# Altium schematic sheet Ethernet HPS Interface.SchDoc (part 2 of 2)
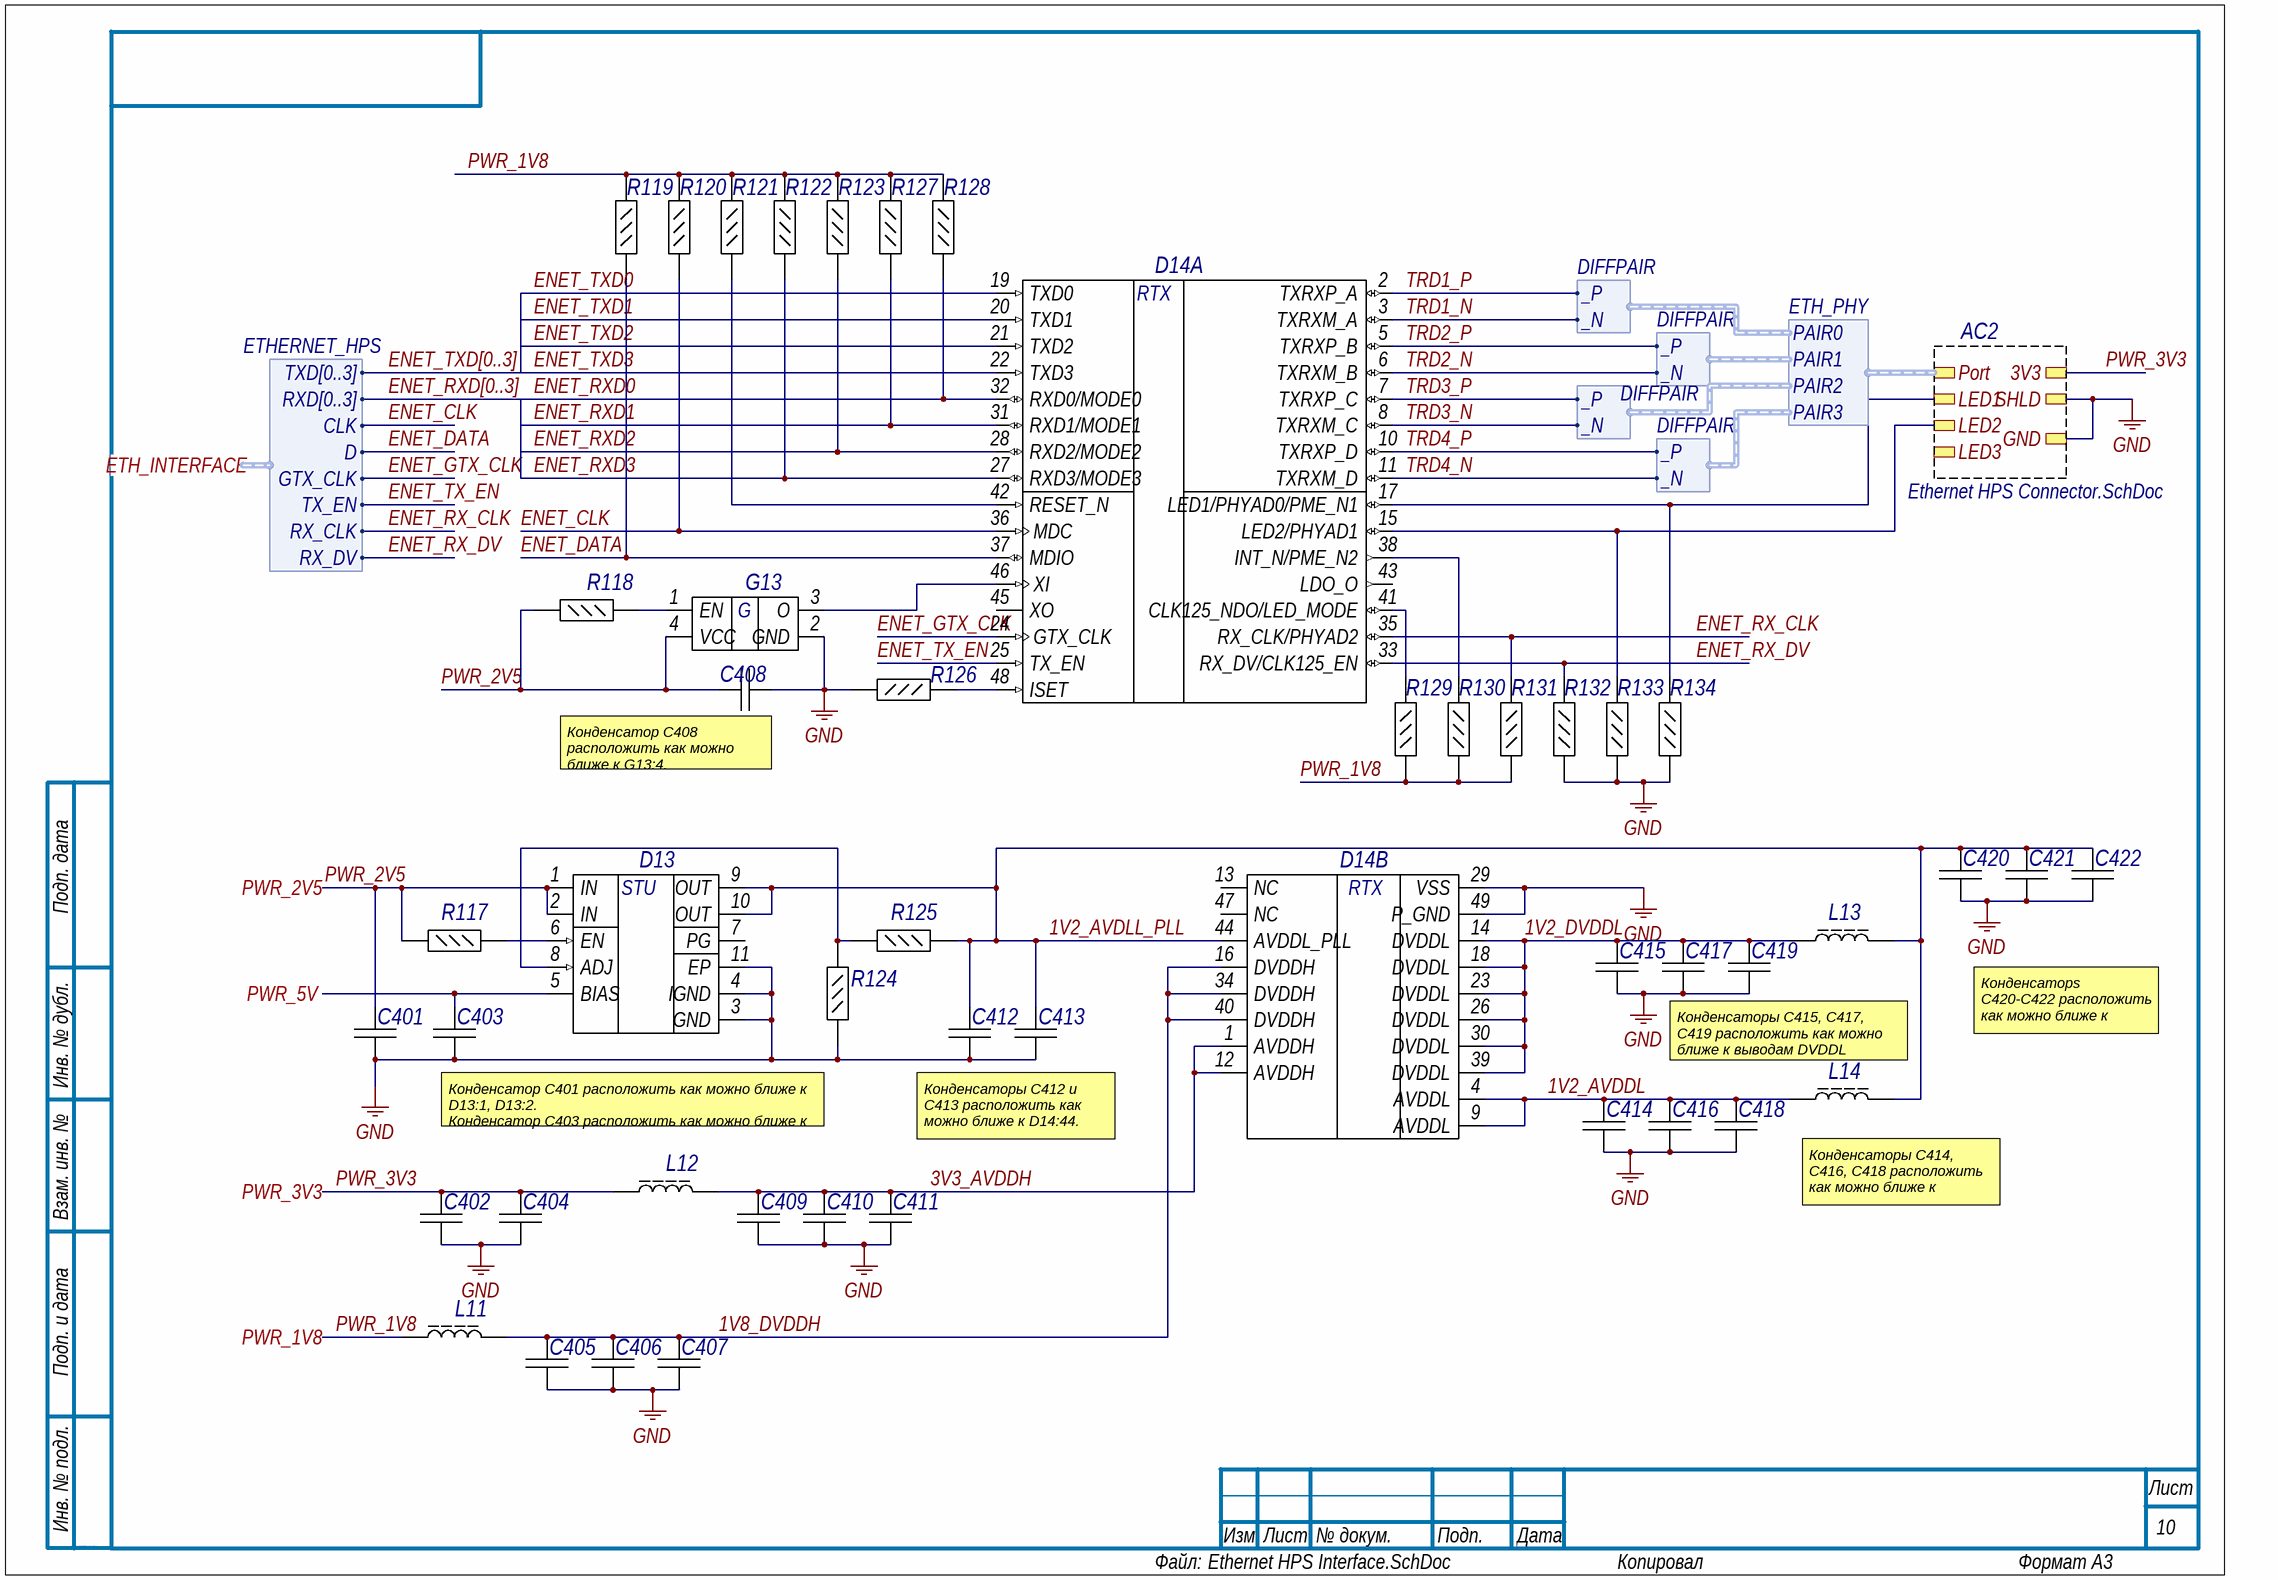
[diagram p1: Ethernet HPS Interface.SchDoc]

## Library data of the parts
C401 = E25: Chip Capacitor, 10 uF, +/- 10%, 16 V, -55 to 85 degC, 0805 (2012 Metric), RoHS, Tape and Reel; Тип элемента: Конденсатор; Capacitance: 10 uF; Case\/Package: 0805; Type (Capacitors): X5R; Voltage Rating: 16 V; Old_des: C370; New_des: C410; UID: E25; Component Kind: Standard; Case Code (Imperial): 0805; Case Code (Metric): 2012; ComponentLink1Description: Manufacturer URL; ComponentLink1URL: http://www.tdk.com/; ComponentLink2Description: Datasheet; ComponentLink2URL: https://product.tdk.com/info/en/catalog/datasheets/mlcc_commercial_general_en.pdf; DatasheetVersion: 03/2015; Length: 2 mm; Max Operating Temperature: 85 degC; Min Operating Temperature: -55 degC; Mounting Technology: Surface Mount; Package Quantity: 1; PackageDescription: 2-Pin Surface Mount Device, Body 2 x 1.25 mm; Packaging: Tape and Reel; RoHSCompliant: true; Tolerance: 10%; Width: 1.25 mm; Height: 0.85 mm; Mount: Surface Mount; PackageReference: 0805; Pins: 2; REACH SVHC: No SVHC; Voltage Rating (DC): 16 V
C402 = E25: Chip Capacitor, 10 uF, +/- 10%, 16 V, -55 to 85 degC, 0805 (2012 Metric), RoHS, Tape and Reel; Тип элемента: Конденсатор; Capacitance: 10 uF; Case\/Package: 0805; Type (Capacitors): X5R; Voltage Rating: 16 V; Old_des: C376; New_des: C411; UID: E25; Component Kind: Standard; Case Code (Imperial): 0805; Case Code (Metric): 2012; ComponentLink1Description: Manufacturer URL; ComponentLink1URL: http://www.tdk.com/; ComponentLink2Description: Datasheet; ComponentLink2URL: https://product.tdk.com/info/en/catalog/datasheets/mlcc_commercial_general_en.pdf; DatasheetVersion: 03/2015; Length: 2 mm; Max Operating Temperature: 85 degC; Min Operating Temperature: -55 degC; Mounting Technology: Surface Mount; Package Quantity: 1; PackageDescription: 2-Pin Surface Mount Device, Body 2 x 1.25 mm; Packaging: Tape and Reel; RoHSCompliant: true; Tolerance: 10%; Width: 1.25 mm; Height: 0.85 mm; Mount: Surface Mount; PackageReference: 0805; Pins: 2; REACH SVHC: No SVHC; Voltage Rating (DC): 16 V
C403 = E2: Chip Capacitor, 1 uF, +/- 10%, 25 V, -55 to 85 degC, 0402 (1005 Metric), RoHS, Tape and Reel; Тип элемента: Конденсатор; Capacitance: 1 uF; Old_des: C384; New_des: C412; UID: E2; Component Kind: Standard; Case Code (Imperial): 0402; Case Code (Metric): 1005; Case/Package: 0402; ComponentLink1Description: Manufacturer URL; ComponentLink1URL: http://www.tdk.com/; ComponentLink2Description: Datasheet; ComponentLink2URL: https://product.tdk.com/info/en/catalog/datasheets/mlcc_commercial_lowprofile_en.pdf; DatasheetVersion: 04/2015; Length: 0.039 inch; Max Operating Temperature: 85 degC; Min Operating Temperature: -55 degC; Mounting Technology: Surface Mount; Package Quantity: 1; PackageDescription: 2-Pin Surface Mount Device, Body 1 x 0.5 mm; Packaging: Tape and Reel; PartNumber: CGB2A1X5R1E105K033BC; RoHSCompliant: True; Tolerance: 10%; Width: 0.02 inch
C404 = E25: Chip Capacitor, 10 uF, +/- 10%, 16 V, -55 to 85 degC, 0805 (2012 Metric), RoHS, Tape and Reel; Тип элемента: Конденсатор; Capacitance: 10 uF; Case\/Package: 0805; Type (Capacitors): X5R; Voltage Rating: 16 V; Old_des: C377; New_des: C413; UID: E25; Component Kind: Standard; Case Code (Imperial): 0805; Case Code (Metric): 2012; ComponentLink1Description: Manufacturer URL; ComponentLink1URL: http://www.tdk.com/; ComponentLink2Description: Datasheet; ComponentLink2URL: https://product.tdk.com/info/en/catalog/datasheets/mlcc_commercial_general_en.pdf; DatasheetVersion: 03/2015; Length: 2 mm; Max Operating Temperature: 85 degC; Min Operating Temperature: -55 degC; Mounting Technology: Surface Mount; Package Quantity: 1; PackageDescription: 2-Pin Surface Mount Device, Body 2 x 1.25 mm; Packaging: Tape and Reel; RoHSCompliant: true; Tolerance: 10%; Width: 1.25 mm; Height: 0.85 mm; Mount: Surface Mount; PackageReference: 0805; Pins: 2; REACH SVHC: No SVHC; Voltage Rating (DC): 16 V
C405 = E5: Chip Capacitor, 22 uF, +/- 10%, 25 V, -55 to 85 degC, 1206 (3216 Metric), RoHS, Tape and Reel; Тип элемента: Конденсатор; Capacitance: 22 uF; Case\/Package: 1206; Type (Capacitors): X5R; Voltage Rating: 25 V; Old_des: C385; New_des: C414; UID: E5; Component Kind: Standard; Case Code (Imperial): 1206; Case Code (Metric): 3216; ComponentLink1Description: Manufacturer URL; ComponentLink1URL: http://www.murata.com/; ComponentLink2Description: Datasheet; ComponentLink2URL: http://search.murata.co.jp/Ceramy/image/img/A01X/G101/ENG/GRM31CR61E226KE15-01.pdf; DatasheetVersion: 03/2016; Length: 3.2 mm; Max Operating Temperature: 85 degC; Min Operating Temperature: -55 degC; Mounting Technology: Surface Mount; Package Quantity: 2000; PackageDescription: 2-Pin Surface Mount Device, Body 3.2 x 1.6 mm; Packaging: Tape and Reel; PartNumber: GRM31CR61E226KE15L; RoHSCompliant: true; Tolerance: 10%; Width: 1.6 mm; Height: 1.6 mm; Mount: Surface Mount; PackageReference: 1206; Pins: 2; Radiation Hardening: No; REACH SVHC: No SVHC; Voltage Rating (DC): 25 V
C406 = E23: Chip Capacitor, 2.2 uF, +/- 10%, 10 V, -55 to 85 degC, 0603 (1608 Metric), RoHS, Tape and Reel; Тип элемента: Конденсатор; Capacitance: 2.2 uF; Old_des: C386; New_des: C415; UID: E23; Component Kind: Standard; Case Code (Imperial): 0603; Case Code (Metric): 1608; Case/Package: 0603; ComponentLink1Description: Manufacturer URL; ComponentLink1URL: http://www.murata.com/; ComponentLink2Description: Datasheet; ComponentLink2URL: https://datasheet.ciiva.com/134/grm188r61a225ke34-01-134206.pdf; DatasheetVersion: 01/2013; Length: 0.063 inch; Max Operating Temperature: 85 degC; Min Operating Temperature: -55 degC; Mounting Technology: Surface Mount; Package Quantity: 10000; PackageDescription: 2-Pin Surface Mount Device, Body 1.6 x 0.8 mm; Packaging: Tape and Reel; PartNumber: GRM188R61A225KE34x; RoHSCompliant: True; Tolerance: 10%; Width: 0.031 inch; Height: 0.8 mm; Radiation Hardening: No
C407 = E11: Chip Capacitor, 0.1 uF, +/- 20%, 25 V, -55 to 125 degC, 0402 (1005 Metric), RoHS, Tape and Reel; Тип элемента: Конденсатор; Capacitance: 100 nF; Case\/Package: 0402; Type (Capacitors): X7R; Voltage Rating: 25 V; Old_des: C387; New_des: C416; UID: E11; Component Kind: Standard; Case Code (Imperial): 0402; Case Code (Metric): 1005; ComponentLink1Description: Manufacturer URL; ComponentLink1URL: http://www.tdk.com/; ComponentLink2Description: Datasheet; ComponentLink2URL: http://www.farnell.com/datasheets/1571323.pdf; DatasheetVersion: 09/2011; Length: 1 mm; Max Operating Temperature: 125 degC; Min Operating Temperature: -55 degC; Mounting Technology: Surface Mount; Package Quantity: 10000; PackageDescription: 2-Pin Surface Mount Device, Body 1 x 0.5 mm; Packaging: Tape and Reel; PartNumber: C1005X7R1E104M; RoHSCompliant: true; Tolerance: 20%; Width: 0.5 mm; Height: 0.5 mm; Mount: Surface Mount; PackageReference: 0402; Pins: 2; Voltage Rating (DC): 25 V
C408 = E3: Chip Capacitor, 10 nF, +/- 10%, 50 V, -55 to 125 degC, 0402 (1005 Metric), RoHS, Tape and Reel; Manufacturer: Basic Passives; Тип элемента: Конденсатор; Capacitance: 10 nF; Case\/Package: 0402; Type (Capacitors): X7R; Voltage Rating: 50 V; Old_des: C366; New_des: C417; UID: E3; Component Kind: Standard; Case Code (Imperial): 0402; Case Code (Metric): 1005; ComponentLink1Description: Manufacturer URL; ComponentLink1URL: http://www.murata.com/; ComponentLink2Description: Datasheet; ComponentLink2URL: http://search.murata.co.jp/Ceramy/image/img/A01X/G101/ENG/GRM155R71H103KA88-01.pdf; DatasheetVersion: 02/2016; Length: 1 mm; Max Operating Temperature: 125 degC; Min Operating Temperature: -55 degC; Mounting Technology: Surface Mount; Package Quantity: 10000; PackageDescription: 2-Pin Surface Mount Device, Body 1 x 0.5 mm; Packaging: Tape and Reel; PartNumber: GRM155R71H103KA88D; RoHSCompliant: true; Tolerance: 10%; Width: 0.5 mm; Height: 0.5 mm; Lead Pitch: 2mm; Mount: Surface Mount; PackageReference: 0402; Pins: 2; Radiation Hardening: No; REACH SVHC: No SVHC; Voltage Rating (DC): 50 V
C409 = E5: Chip Capacitor, 22 uF, +/- 10%, 25 V, -55 to 85 degC, 1206 (3216 Metric), RoHS, Tape and Reel; Тип элемента: Конденсатор; Capacitance: 22 uF; Case\/Package: 1206; Type (Capacitors): X5R; Voltage Rating: 25 V; Old_des: C378; New_des: C418; UID: E5; Component Kind: Standard; Case Code (Imperial): 1206; Case Code (Metric): 3216; ComponentLink1Description: Manufacturer URL; ComponentLink1URL: http://www.murata.com/; ComponentLink2Description: Datasheet; ComponentLink2URL: http://search.murata.co.jp/Ceramy/image/img/A01X/G101/ENG/GRM31CR61E226KE15-01.pdf; DatasheetVersion: 03/2016; Length: 3.2 mm; Max Operating Temperature: 85 degC; Min Operating Temperature: -55 degC; Mounting Technology: Surface Mount; Package Quantity: 2000; PackageDescription: 2-Pin Surface Mount Device, Body 3.2 x 1.6 mm; Packaging: Tape and Reel; PartNumber: GRM31CR61E226KE15L; RoHSCompliant: true; Tolerance: 10%; Width: 1.6 mm; Height: 1.6 mm; Mount: Surface Mount; PackageReference: 1206; Pins: 2; Radiation Hardening: No; REACH SVHC: No SVHC; Voltage Rating (DC): 25 V
C410 = E23: Chip Capacitor, 2.2 uF, +/- 10%, 10 V, -55 to 85 degC, 0603 (1608 Metric), RoHS, Tape and Reel; Тип элемента: Конденсатор; Capacitance: 2.2 uF; Old_des: C379; New_des: C419; UID: E23; Component Kind: Standard; Case Code (Imperial): 0603; Case Code (Metric): 1608; Case/Package: 0603; ComponentLink1Description: Manufacturer URL; ComponentLink1URL: http://www.murata.com/; ComponentLink2Description: Datasheet; ComponentLink2URL: https://datasheet.ciiva.com/134/grm188r61a225ke34-01-134206.pdf; DatasheetVersion: 01/2013; Length: 0.063 inch; Max Operating Temperature: 85 degC; Min Operating Temperature: -55 degC; Mounting Technology: Surface Mount; Package Quantity: 10000; PackageDescription: 2-Pin Surface Mount Device, Body 1.6 x 0.8 mm; Packaging: Tape and Reel; PartNumber: GRM188R61A225KE34x; RoHSCompliant: True; Tolerance: 10%; Width: 0.031 inch; Height: 0.8 mm; Radiation Hardening: No
C411 = E11: Chip Capacitor, 0.1 uF, +/- 20%, 25 V, -55 to 125 degC, 0402 (1005 Metric), RoHS, Tape and Reel; Тип элемента: Конденсатор; Capacitance: 100 nF; Case\/Package: 0402; Type (Capacitors): X7R; Voltage Rating: 25 V; Old_des: C380; New_des: C420; UID: E11; Component Kind: Standard; Case Code (Imperial): 0402; Case Code (Metric): 1005; ComponentLink1Description: Manufacturer URL; ComponentLink1URL: http://www.tdk.com/; ComponentLink2Description: Datasheet; ComponentLink2URL: http://www.farnell.com/datasheets/1571323.pdf; DatasheetVersion: 09/2011; Length: 1 mm; Max Operating Temperature: 125 degC; Min Operating Temperature: -55 degC; Mounting Technology: Surface Mount; Package Quantity: 10000; PackageDescription: 2-Pin Surface Mount Device, Body 1 x 0.5 mm; Packaging: Tape and Reel; PartNumber: C1005X7R1E104M; RoHSCompliant: true; Tolerance: 20%; Width: 0.5 mm; Height: 0.5 mm; Mount: Surface Mount; PackageReference: 0402; Pins: 2; Voltage Rating (DC): 25 V
C412 = E5: Chip Capacitor, 22 uF, +/- 10%, 25 V, -55 to 85 degC, 1206 (3216 Metric), RoHS, Tape and Reel; Тип элемента: Конденсатор; Capacitance: 22 uF; Case\/Package: 1206; Type (Capacitors): X5R; Voltage Rating: 25 V; Old_des: C374; New_des: C421; UID: E5; Component Kind: Standard; Case Code (Imperial): 1206; Case Code (Metric): 3216; ComponentLink1Description: Manufacturer URL; ComponentLink1URL: http://www.murata.com/; ComponentLink2Description: Datasheet; ComponentLink2URL: http://search.murata.co.jp/Ceramy/image/img/A01X/G101/ENG/GRM31CR61E226KE15-01.pdf; DatasheetVersion: 03/2016; Length: 3.2 mm; Max Operating Temperature: 85 degC; Min Operating Temperature: -55 degC; Mounting Technology: Surface Mount; Package Quantity: 2000; PackageDescription: 2-Pin Surface Mount Device, Body 3.2 x 1.6 mm; Packaging: Tape and Reel; PartNumber: GRM31CR61E226KE15L; RoHSCompliant: true; Tolerance: 10%; Width: 1.6 mm; Height: 1.6 mm; Mount: Surface Mount; PackageReference: 1206; Pins: 2; Radiation Hardening: No; REACH SVHC: No SVHC; Voltage Rating (DC): 25 V
C413 = E23: Chip Capacitor, 2.2 uF, +/- 10%, 10 V, -55 to 85 degC, 0603 (1608 Metric), RoHS, Tape and Reel; Тип элемента: Конденсатор; Capacitance: 2.2 uF; Old_des: C375; New_des: C422; UID: E23; Component Kind: Standard; Case Code (Imperial): 0603; Case Code (Metric): 1608; Case/Package: 0603; ComponentLink1Description: Manufacturer URL; ComponentLink1URL: http://www.murata.com/; ComponentLink2Description: Datasheet; ComponentLink2URL: https://datasheet.ciiva.com/134/grm188r61a225ke34-01-134206.pdf; DatasheetVersion: 01/2013; Length: 0.063 inch; Max Operating Temperature: 85 degC; Min Operating Temperature: -55 degC; Mounting Technology: Surface Mount; Package Quantity: 10000; PackageDescription: 2-Pin Surface Mount Device, Body 1.6 x 0.8 mm; Packaging: Tape and Reel; PartNumber: GRM188R61A225KE34x; RoHSCompliant: True; Tolerance: 10%; Width: 0.031 inch; Height: 0.8 mm; Radiation Hardening: No
C414 = E11: Chip Capacitor, 0.1 uF, +/- 20%, 25 V, -55 to 125 degC, 0402 (1005 Metric), RoHS, Tape and Reel; Тип элемента: Конденсатор; Capacitance: 100 nF; Case\/Package: 0402; Type (Capacitors): X7R; Voltage Rating: 25 V; Old_des: C373; New_des: C423; UID: E11; Component Kind: Standard; Case Code (Imperial): 0402; Case Code (Metric): 1005; ComponentLink1Description: Manufacturer URL; ComponentLink1URL: http://www.tdk.com/; ComponentLink2Description: Datasheet; ComponentLink2URL: http://www.farnell.com/datasheets/1571323.pdf; DatasheetVersion: 09/2011; Length: 1 mm; Max Operating Temperature: 125 degC; Min Operating Temperature: -55 degC; Mounting Technology: Surface Mount; Package Quantity: 10000; PackageDescription: 2-Pin Surface Mount Device, Body 1 x 0.5 mm; Packaging: Tape and Reel; PartNumber: C1005X7R1E104M; RoHSCompliant: true; Tolerance: 20%; Width: 0.5 mm; Height: 0.5 mm; Mount: Surface Mount; PackageReference: 0402; Pins: 2; Voltage Rating (DC): 25 V
C415 = E11: Chip Capacitor, 0.1 uF, +/- 20%, 25 V, -55 to 125 degC, 0402 (1005 Metric), RoHS, Tape and Reel; Тип элемента: Конденсатор; Capacitance: 100 nF; Case\/Package: 0402; Type (Capacitors): X7R; Voltage Rating: 25 V; Old_des: C383; New_des: C424; UID: E11; Component Kind: Standard; Case Code (Imperial): 0402; Case Code (Metric): 1005; ComponentLink1Description: Manufacturer URL; ComponentLink1URL: http://www.tdk.com/; ComponentLink2Description: Datasheet; ComponentLink2URL: http://www.farnell.com/datasheets/1571323.pdf; DatasheetVersion: 09/2011; Length: 1 mm; Max Operating Temperature: 125 degC; Min Operating Temperature: -55 degC; Mounting Technology: Surface Mount; Package Quantity: 10000; PackageDescription: 2-Pin Surface Mount Device, Body 1 x 0.5 mm; Packaging: Tape and Reel; PartNumber: C1005X7R1E104M; RoHSCompliant: true; Tolerance: 20%; Width: 0.5 mm; Height: 0.5 mm; Mount: Surface Mount; PackageReference: 0402; Pins: 2; Voltage Rating (DC): 25 V
C416 = E23: Chip Capacitor, 2.2 uF, +/- 10%, 10 V, -55 to 85 degC, 0603 (1608 Metric), RoHS, Tape and Reel; Тип элемента: Конденсатор; Capacitance: 2.2 uF; Old_des: C372; New_des: C425; UID: E23; Component Kind: Standard; Case Code (Imperial): 0603; Case Code (Metric): 1608; Case/Package: 0603; ComponentLink1Description: Manufacturer URL; ComponentLink1URL: http://www.murata.com/; ComponentLink2Description: Datasheet; ComponentLink2URL: https://datasheet.ciiva.com/134/grm188r61a225ke34-01-134206.pdf; DatasheetVersion: 01/2013; Length: 0.063 inch; Max Operating Temperature: 85 degC; Min Operating Temperature: -55 degC; Mounting Technology: Surface Mount; Package Quantity: 10000; PackageDescription: 2-Pin Surface Mount Device, Body 1.6 x 0.8 mm; Packaging: Tape and Reel; PartNumber: GRM188R61A225KE34x; RoHSCompliant: True; Tolerance: 10%; Width: 0.031 inch; Height: 0.8 mm; Radiation Hardening: No
C417 = E23: Chip Capacitor, 2.2 uF, +/- 10%, 10 V, -55 to 85 degC, 0603 (1608 Metric), RoHS, Tape and Reel; Тип элемента: Конденсатор; Capacitance: 2.2 uF; Old_des: C382; New_des: C426; UID: E23; Component Kind: Standard; Case Code (Imperial): 0603; Case Code (Metric): 1608; Case/Package: 0603; ComponentLink1Description: Manufacturer URL; ComponentLink1URL: http://www.murata.com/; ComponentLink2Description: Datasheet; ComponentLink2URL: https://datasheet.ciiva.com/134/grm188r61a225ke34-01-134206.pdf; DatasheetVersion: 01/2013; Length: 0.063 inch; Max Operating Temperature: 85 degC; Min Operating Temperature: -55 degC; Mounting Technology: Surface Mount; Package Quantity: 10000; PackageDescription: 2-Pin Surface Mount Device, Body 1.6 x 0.8 mm; Packaging: Tape and Reel; PartNumber: GRM188R61A225KE34x; RoHSCompliant: True; Tolerance: 10%; Width: 0.031 inch; Height: 0.8 mm; Radiation Hardening: No
C418 = E5: Chip Capacitor, 22 uF, +/- 10%, 25 V, -55 to 85 degC, 1206 (3216 Metric), RoHS, Tape and Reel; Тип элемента: Конденсатор; Capacitance: 22 uF; Case\/Package: 1206; Type (Capacitors): X5R; Voltage Rating: 25 V; Old_des: C371; New_des: C427; UID: E5; Component Kind: Standard; Case Code (Imperial): 1206; Case Code (Metric): 3216; ComponentLink1Description: Manufacturer URL; ComponentLink1URL: http://www.murata.com/; ComponentLink2Description: Datasheet; ComponentLink2URL: http://search.murata.co.jp/Ceramy/image/img/A01X/G101/ENG/GRM31CR61E226KE15-01.pdf; DatasheetVersion: 03/2016; Length: 3.2 mm; Max Operating Temperature: 85 degC; Min Operating Temperature: -55 degC; Mounting Technology: Surface Mount; Package Quantity: 2000; PackageDescription: 2-Pin Surface Mount Device, Body 3.2 x 1.6 mm; Packaging: Tape and Reel; PartNumber: GRM31CR61E226KE15L; RoHSCompliant: true; Tolerance: 10%; Width: 1.6 mm; Height: 1.6 mm; Mount: Surface Mount; PackageReference: 1206; Pins: 2; Radiation Hardening: No; REACH SVHC: No SVHC; Voltage Rating (DC): 25 V
C419 = E5: Chip Capacitor, 22 uF, +/- 10%, 25 V, -55 to 85 degC, 1206 (3216 Metric), RoHS, Tape and Reel; Тип элемента: Конденсатор; Capacitance: 22 uF; Case\/Package: 1206; Type (Capacitors): X5R; Voltage Rating: 25 V; Old_des: C381; New_des: C428; UID: E5; Component Kind: Standard; Case Code (Imperial): 1206; Case Code (Metric): 3216; ComponentLink1Description: Manufacturer URL; ComponentLink1URL: http://www.murata.com/; ComponentLink2Description: Datasheet; ComponentLink2URL: http://search.murata.co.jp/Ceramy/image/img/A01X/G101/ENG/GRM31CR61E226KE15-01.pdf; DatasheetVersion: 03/2016; Length: 3.2 mm; Max Operating Temperature: 85 degC; Min Operating Temperature: -55 degC; Mounting Technology: Surface Mount; Package Quantity: 2000; PackageDescription: 2-Pin Surface Mount Device, Body 3.2 x 1.6 mm; Packaging: Tape and Reel; PartNumber: GRM31CR61E226KE15L; RoHSCompliant: true; Tolerance: 10%; Width: 1.6 mm; Height: 1.6 mm; Mount: Surface Mount; PackageReference: 1206; Pins: 2; Radiation Hardening: No; REACH SVHC: No SVHC; Voltage Rating (DC): 25 V
C420 = E11: Chip Capacitor, 0.1 uF, +/- 20%, 25 V, -55 to 125 degC, 0402 (1005 Metric), RoHS, Tape and Reel; Тип элемента: Конденсатор; Capacitance: 100 nF; Case\/Package: 0402; Type (Capacitors): X7R; Voltage Rating: 25 V; Old_des: C369; New_des: C429; UID: E11; Component Kind: Standard; Case Code (Imperial): 0402; Case Code (Metric): 1005; ComponentLink1Description: Manufacturer URL; ComponentLink1URL: http://www.tdk.com/; ComponentLink2Description: Datasheet; ComponentLink2URL: http://www.farnell.com/datasheets/1571323.pdf; DatasheetVersion: 09/2011; Length: 1 mm; Max Operating Temperature: 125 degC; Min Operating Temperature: -55 degC; Mounting Technology: Surface Mount; Package Quantity: 10000; PackageDescription: 2-Pin Surface Mount Device, Body 1 x 0.5 mm; Packaging: Tape and Reel; PartNumber: C1005X7R1E104M; RoHSCompliant: true; Tolerance: 20%; Width: 0.5 mm; Height: 0.5 mm; Mount: Surface Mount; PackageReference: 0402; Pins: 2; Voltage Rating (DC): 25 V
C421 = E23: Chip Capacitor, 2.2 uF, +/- 10%, 10 V, -55 to 85 degC, 0603 (1608 Metric), RoHS, Tape and Reel; Тип элемента: Конденсатор; Capacitance: 2.2 uF; Old_des: C368; New_des: C430; UID: E23; Component Kind: Standard; Case Code (Imperial): 0603; Case Code (Metric): 1608; Case/Package: 0603; ComponentLink1Description: Manufacturer URL; ComponentLink1URL: http://www.murata.com/; ComponentLink2Description: Datasheet; ComponentLink2URL: https://datasheet.ciiva.com/134/grm188r61a225ke34-01-134206.pdf; DatasheetVersion: 01/2013; Length: 0.063 inch; Max Operating Temperature: 85 degC; Min Operating Temperature: -55 degC; Mounting Technology: Surface Mount; Package Quantity: 10000; PackageDescription: 2-Pin Surface Mount Device, Body 1.6 x 0.8 mm; Packaging: Tape and Reel; PartNumber: GRM188R61A225KE34x; RoHSCompliant: True; Tolerance: 10%; Width: 0.031 inch; Height: 0.8 mm; Radiation Hardening: No
C422 = E5: Chip Capacitor, 22 uF, +/- 10%, 25 V, -55 to 85 degC, 1206 (3216 Metric), RoHS, Tape and Reel; Тип элемента: Конденсатор; Capacitance: 22 uF; Case\/Package: 1206; Type (Capacitors): X5R; Voltage Rating: 25 V; Old_des: C367; New_des: C431; UID: E5; Component Kind: Standard; Case Code (Imperial): 1206; Case Code (Metric): 3216; ComponentLink1Description: Manufacturer URL; ComponentLink1URL: http://www.murata.com/; ComponentLink2Description: Datasheet; ComponentLink2URL: http://search.murata.co.jp/Ceramy/image/img/A01X/G101/ENG/GRM31CR61E226KE15-01.pdf; DatasheetVersion: 03/2016; Length: 3.2 mm; Max Operating Temperature: 85 degC; Min Operating Temperature: -55 degC; Mounting Technology: Surface Mount; Package Quantity: 2000; PackageDescription: 2-Pin Surface Mount Device, Body 3.2 x 1.6 mm; Packaging: Tape and Reel; PartNumber: GRM31CR61E226KE15L; RoHSCompliant: true; Tolerance: 10%; Width: 1.6 mm; Height: 1.6 mm; Mount: Surface Mount; PackageReference: 1206; Pins: 2; Radiation Hardening: No; REACH SVHC: No SVHC; Voltage Rating (DC): 25 V
D13 = E120: 1.5 A Low Input Voltage VLDO Linear Regulator, Boost Converter Disabled, Require 5 V External Supply, 1.14 to 5.5 V Vin, Adjustable Vout, 10-pin SON (DD-10), -40 to 125 degC, Pb-Free; Manufacturer: Linear Technology; Тип элемента: Стабилизатор; Discrete Pass Element: no; Dropout Voltage(V): 0.1; Iout(mA): 1500; Isupply(mA): 0.095; Noise(uV): 110; Number of Outputs: 1; Output Voltage: Adj; Shutdown Current(uA): 0.6; Vin Max(V): 5.5; Vin Min(V): 1.14; Vout Max(V): 2.6; Vout Min(V): 0.4; PSRR(dB): 42; Old_des: U25; New_des: D14; UID: E120; Component Kind: Standard; ComponentLink1Description: Manufacturer URL; ComponentLink1URL: http://www.linear.com/; ComponentLink2Description: Datasheet; ComponentLink2URL: http://cds.linear.com/docs/en/datasheet/30261f.pdf; Mounting Technology: Surface Mount; PackageDescription: 10-Pin Plastic DFN, Body 3 x 3 mm, Pitch 0.5 mm; PartNumber: LTC3026EDD-1#PBF; PackageReference: DD-10; Code_JEDEC: MO-229; ComponentLink3Description: Package Specification; ComponentLink3URL: http://cds.linear.com/docs/en/packaging/DFN_10_05-08-1699.pdf; PackageVersion: Rev. C, 06/2010; RoHS: TRUE
D14 = E111: Gigabit Ethernet Transceiver with RGMII Support, 1.14 to 1.26 V, 0 to 70 degC, 48-Pin QFN, RoHS; Manufacturer: Micrel; Тип элемента: Приёмник/передатчик; Drivers: 4; ILED: 8 mA Typ.; Output Tri-State Leakage: 10 uA Max.; VSET@R(ISET): 12.1 KOhm=1.2 V Typ.; Old_des: U11; New_des: D15; UID: E111; Component Kind: Standard; ComponentLink1Description: Manufacturer URL; ComponentLink1URL: http://www.micrel.com/; ComponentLink2Description: Datasheet; ComponentLink2URL: http://www.micrel.com/_PDF/Ethernet/datasheets/KSZ9031RNX.pdf; DatasheetVersion: Rev. 2.1; Mounting Technology: Surface Mount; PackageDescription: 48-Pin Quad Flat Non-Lead Package, Body 7 x 7 mm, Pitch 0.5 mm; PartNumber: KSZ9031RNXCA; ComponentLink3Description: Package Specification; ComponentLink3URL: http://www.micrel.com/_PDF/Ethernet/datasheets/KSZ9031RNX.pdf; RoHS: TRUE; DVDDL: 1.14 to 1.26 V; Receivers: 4; Temperature Range: 0 to 70 degC
G13 = E117: Crystal Oscillator (SPXO), 2.5 V, 25 MHz, -20 to 70 degC, 4-Pin SMD, RoHS, Tape and Reel; Тип элемента: Генератор; Old_des: U24; New_des: G13; UID: E117; Component Kind: Standard; ComponentLink1Description: Manufacturer URL; ComponentLink1URL: https://www.eea.epson.com/; ComponentLink2Description: Datasheet; ComponentLink2URL: http://www5.epsondevice.com/en/products/spxo_standard/sg310sdf.html#; DatasheetVersion: Rev. Feb-15; Length: 3.2 mm; Max Operating Temperature: 70 degC; Min Operating Temperature: -20 degC; Mounting Technology: Surface Mount; PackageDescription: 4-Pin Surface Mount Device, Body 3.2 x 2.5 mm; Packaging: Tape and Reel; PartNumber: SG-310SDF 25.0000M-B3; RoHSCompliant: True; Width: 2.5 mm; Height: 1.05 mm
L11 = E45: SMD EMI Suppression Ferrite Bead WE-CBF, Z = 30 Ohm; Тип элемента: Ферритовый дроссель; Impedance: 30 Ohm; Old_des: L14; New_des: L12; UID: E45; Component Kind: Standard; ComponentLink1Description: Manufacturer Link; ComponentLink1URL: http://www.we-online.com; ComponentLink2Description: Datasheet; ComponentLink2URL: http://www.we-online.de/katalog/media/pdf/742792609.pdf; DatasheetVersion: Dec-2005; PackageDescription: Chip Inductor, 2-Leads, Body 1.6 x 0.8 mm; PackageReference: SMD-0603; PackageVersion: 2009
L12 = E45: SMD EMI Suppression Ferrite Bead WE-CBF, Z = 30 Ohm; Тип элемента: Ферритовый дроссель; Impedance: 30 Ohm; Old_des: L12; New_des: L13; UID: E45; Component Kind: Standard; ComponentLink1Description: Manufacturer Link; ComponentLink1URL: http://www.we-online.com; ComponentLink2Description: Datasheet; ComponentLink2URL: http://www.we-online.de/katalog/media/pdf/742792609.pdf; DatasheetVersion: Dec-2005; PackageDescription: Chip Inductor, 2-Leads, Body 1.6 x 0.8 mm; PackageReference: SMD-0603; PackageVersion: 2009
L13 = E45: SMD EMI Suppression Ferrite Bead WE-CBF, Z = 30 Ohm; Тип элемента: Ферритовый дроссель; Impedance: 30 Ohm; Old_des: L13; New_des: L15; UID: E45; Component Kind: Standard; ComponentLink1Description: Manufacturer Link; ComponentLink1URL: http://www.we-online.com; ComponentLink2Description: Datasheet; ComponentLink2URL: http://www.we-online.de/katalog/media/pdf/742792609.pdf; DatasheetVersion: Dec-2005; PackageDescription: Chip Inductor, 2-Leads, Body 1.6 x 0.8 mm; PackageReference: SMD-0603; PackageVersion: 2009
L14 = E45: SMD EMI Suppression Ferrite Bead WE-CBF, Z = 30 Ohm; Тип элемента: Ферритовый дроссель; Impedance: 30 Ohm; Old_des: L11; New_des: L14; UID: E45; Component Kind: Standard; ComponentLink1Description: Manufacturer Link; ComponentLink1URL: http://www.we-online.com; ComponentLink2Description: Datasheet; ComponentLink2URL: http://www.we-online.de/katalog/media/pdf/742792609.pdf; DatasheetVersion: Dec-2005; PackageDescription: Chip Inductor, 2-Leads, Body 1.6 x 0.8 mm; PackageReference: SMD-0603; PackageVersion: 2009
R117 = E60: Chip Resistor, 10 KOhm, +/- 1%, 100 mW, -55 to 155 degC, 0402 (1005 Metric), RoHS, Tape and Reel; Manufacturer: Basic Passives; Тип элемента: Резистор; Case\/Package: 0402; Voltage Rating: 50 V; Power Rating: 100 mW; Resistance: 10 KOhm; Old_des: R316; New_des: R136; UID: E60; Component Kind: Standard; Case Code (Imperial): 0402; Case Code (Metric): 1005; ComponentLink1Description: Manufacturer URL; ComponentLink1URL: http://www.panasonic.com/; ComponentLink2Description: Datasheet; ComponentLink2URL: http://industrial.panasonic.com/cdbs/www-data/pdf/RDA0000/AOA0000C86.pdf; DatasheetVersion: 04/2015; Length: 1 mm; Max Operating Temperature: 155 degC; Min Operating Temperature: -55 degC; Mounting Technology: Surface Mount; Package Quantity: 10000; PackageDescription: 2-Pin Surface Mount Device, Body 1 x 0.5 mm; Packaging: Tape and Reel; PartNumber: ERJ-2RKF1002X; RoHSCompliant: true; Tolerance: 1%; Width: 0.5 mm; Height: 0.35 mm; Mount: Surface Mount; PackageReference: 0402; Pins: 2; Radiation Hardening: No; REACH SVHC: Yes
R118 = E60: Chip Resistor, 10 KOhm, +/- 1%, 100 mW, -55 to 155 degC, 0402 (1005 Metric), RoHS, Tape and Reel; Manufacturer: Basic Passives; Тип элемента: Резистор; Case\/Package: 0402; Voltage Rating: 50 V; Power Rating: 100 mW; Resistance: 10 KOhm; Old_des: R311; New_des: R137; UID: E60; Component Kind: Standard; Case Code (Imperial): 0402; Case Code (Metric): 1005; ComponentLink1Description: Manufacturer URL; ComponentLink1URL: http://www.panasonic.com/; ComponentLink2Description: Datasheet; ComponentLink2URL: http://industrial.panasonic.com/cdbs/www-data/pdf/RDA0000/AOA0000C86.pdf; DatasheetVersion: 04/2015; Length: 1 mm; Max Operating Temperature: 155 degC; Min Operating Temperature: -55 degC; Mounting Technology: Surface Mount; Package Quantity: 10000; PackageDescription: 2-Pin Surface Mount Device, Body 1 x 0.5 mm; Packaging: Tape and Reel; PartNumber: ERJ-2RKF1002X; RoHSCompliant: true; Tolerance: 1%; Width: 0.5 mm; Height: 0.35 mm; Mount: Surface Mount; PackageReference: 0402; Pins: 2; Radiation Hardening: No; REACH SVHC: Yes
R119 = E67: Chip Resistor, 49.9 Ohm, +/- 1%, 0.06 W, -55 to 155 degC, 0402 (1005 Metric), RoHS, Tape and Reel; Тип элемента: Резистор; Old_des: R300; New_des: R138; UID: E67; Component Kind: Standard; Case/Package: 0402; ComponentLink1Description: Manufacturer URL; ComponentLink1URL: http://www.niccomp.com/; ComponentLink2Description: Datasheet; ComponentLink2URL: https://datasheet.ciiva.com/27056/2008575-27056094.pdf; DatasheetVersion: 11/2008; Length: 1 mm; Max Operating Temperature: 155 degC; Min Operating Temperature: -55 degC; Mounting Technology: Surface Mount; PackageDescription: 2-Pin Surface Mount Device, Body 1 x 0.5 mm; Packaging: Tape and Reel; PartNumber: NRC04F49R9TRF; RoHSCompliant: True; Tolerance: 1%; Height: 0.3 mm; Radiation Hardening: No; Resistance: 49.9 Ohm
R120 = E99: Chip Resistor, 4.7 KOhm, +/- 1%, 0.1 W, -55 to 155 degC, 0402 (1005 Metric), RoHS, Tape and Reel; Тип элемента: Резистор; Case\/Package: 0402; Voltage Rating: 50 V; Power Rating: 100 mW; Old_des: R302; New_des: R139; UID: E99; Component Kind: Standard; Case Code (Imperial): 0402; Case Code (Metric): 1005; ComponentLink1Description: Manufacturer URL; ComponentLink1URL: http://www.panasonic.com/; ComponentLink2Description: Datasheet; ComponentLink2URL: http://industrial.panasonic.com/cdbs/www-data/pdf/RDA0000/AOA0000C86.pdf; DatasheetVersion: 04/2015; Length: 1 mm; Max Operating Temperature: 155 degC; Min Operating Temperature: -55 degC; Mounting Technology: Surface Mount; Package Quantity: 1; PackageDescription: 2-Pin Surface Mount Device, Body 1 x 0.5 mm; Packaging: Cut Tape; PartNumber: ERJ-2RKF4701X; RoHSCompliant: true; Tolerance: 1%; Width: 0.5 mm; Height: 0.35 mm; Mount: Surface Mount; PackageReference: 0402; Pins: 2; Radiation Hardening: No; REACH SVHC: Yes; Resistance: 4.7 KOhm
R121 = E67: Chip Resistor, 49.9 Ohm, +/- 1%, 0.06 W, -55 to 155 degC, 0402 (1005 Metric), RoHS, Tape and Reel; Тип элемента: Резистор; Old_des: R301; New_des: R140; UID: E67; Component Kind: Standard; Case/Package: 0402; ComponentLink1Description: Manufacturer URL; ComponentLink1URL: http://www.niccomp.com/; ComponentLink2Description: Datasheet; ComponentLink2URL: https://datasheet.ciiva.com/27056/2008575-27056094.pdf; DatasheetVersion: 11/2008; Length: 1 mm; Max Operating Temperature: 155 degC; Min Operating Temperature: -55 degC; Mounting Technology: Surface Mount; PackageDescription: 2-Pin Surface Mount Device, Body 1 x 0.5 mm; Packaging: Tape and Reel; PartNumber: NRC04F49R9TRF; RoHSCompliant: True; Tolerance: 1%; Height: 0.3 mm; Radiation Hardening: No; Resistance: 49.9 Ohm
R122 = E99: Chip Resistor, 4.7 KOhm, +/- 1%, 0.1 W, -55 to 155 degC, 0402 (1005 Metric), RoHS, Tape and Reel; Тип элемента: Резистор; Case\/Package: 0402; Voltage Rating: 50 V; Power Rating: 100 mW; Old_des: R303; New_des: R141; UID: E99; Component Kind: Standard; Case Code (Imperial): 0402; Case Code (Metric): 1005; ComponentLink1Description: Manufacturer URL; ComponentLink1URL: http://www.panasonic.com/; ComponentLink2Description: Datasheet; ComponentLink2URL: http://industrial.panasonic.com/cdbs/www-data/pdf/RDA0000/AOA0000C86.pdf; DatasheetVersion: 04/2015; Length: 1 mm; Max Operating Temperature: 155 degC; Min Operating Temperature: -55 degC; Mounting Technology: Surface Mount; Package Quantity: 1; PackageDescription: 2-Pin Surface Mount Device, Body 1 x 0.5 mm; Packaging: Cut Tape; PartNumber: ERJ-2RKF4701X; RoHSCompliant: true; Tolerance: 1%; Width: 0.5 mm; Height: 0.35 mm; Mount: Surface Mount; PackageReference: 0402; Pins: 2; Radiation Hardening: No; REACH SVHC: Yes; Resistance: 4.7 KOhm
R123 = E99: Chip Resistor, 4.7 KOhm, +/- 1%, 0.1 W, -55 to 155 degC, 0402 (1005 Metric), RoHS, Tape and Reel; Тип элемента: Резистор; Case\/Package: 0402; Voltage Rating: 50 V; Power Rating: 100 mW; Old_des: R306; New_des: R143; UID: E99; Component Kind: Standard; Case Code (Imperial): 0402; Case Code (Metric): 1005; ComponentLink1Description: Manufacturer URL; ComponentLink1URL: http://www.panasonic.com/; ComponentLink2Description: Datasheet; ComponentLink2URL: http://industrial.panasonic.com/cdbs/www-data/pdf/RDA0000/AOA0000C86.pdf; DatasheetVersion: 04/2015; Length: 1 mm; Max Operating Temperature: 155 degC; Min Operating Temperature: -55 degC; Mounting Technology: Surface Mount; Package Quantity: 1; PackageDescription: 2-Pin Surface Mount Device, Body 1 x 0.5 mm; Packaging: Cut Tape; PartNumber: ERJ-2RKF4701X; RoHSCompliant: true; Tolerance: 1%; Width: 0.5 mm; Height: 0.35 mm; Mount: Surface Mount; PackageReference: 0402; Pins: 2; Radiation Hardening: No; REACH SVHC: Yes; Resistance: 4.7 KOhm
R124 = E59: Chip Resistor, 1 KOhm, +/- 1%, 100 mW, -55 to 155 degC, 0402 (1005 Metric), RoHS, Tape and Reel; Manufacturer: Basic Passives; Тип элемента: Резистор; Case\/Package: 0402; Voltage Rating: 50 V; Power Rating: 100 mW; Resistance: 1 KOhm; Old_des: R315; New_des: R142; UID: E59; Component Kind: Standard; Case Code (Imperial): 0402; Case Code (Metric): 1005; ComponentLink1Description: Manufacturer URL; ComponentLink1URL: http://www.panasonic.com/; ComponentLink2Description: Datasheet; ComponentLink2URL: http://industrial.panasonic.com/cdbs/www-data/pdf/RDA0000/AOA0000C86.pdf; DatasheetVersion: 04/2015; Length: 1 mm; Max Operating Temperature: 155 degC; Min Operating Temperature: -55 degC; Mounting Technology: Surface Mount; Package Quantity: 10000; PackageDescription: 2-Pin Surface Mount Device, Body 1 x 0.5 mm; Packaging: Tape and Reel; PartNumber: ERJ-2RKF1001X; RoHSCompliant: true; Tolerance: 1%; Width: 0.5 mm; Height: 0.35 mm; Mount: Surface Mount; PackageReference: 0402; Pins: 2; Radiation Hardening: No; REACH SVHC: Yes
R125 = E96: Chip Resistor, 2 KOhm, +/- 1%, 100 mW, -55 to 155 degC, 0402 (1005 Metric), RoHS, Tape and Reel; Manufacturer: Basic Passives; Тип элемента: Резистор; Case\/Package: 0402; Voltage Rating: 50 V; Power Rating: 100 mW; Resistance: 2 KOhm; Old_des: R314; New_des: R144; UID: E96; Component Kind: Standard; Case Code (Imperial): 0402; Case Code (Metric): 1005; ComponentLink1Description: Manufacturer URL; ComponentLink1URL: http://www.panasonic.com/; ComponentLink2Description: Datasheet; ComponentLink2URL: http://industrial.panasonic.com/cdbs/www-data/pdf/RDA0000/AOA0000C86.pdf; DatasheetVersion: 04/2015; Length: 1 mm; Max Operating Temperature: 155 degC; Min Operating Temperature: -55 degC; Mounting Technology: Surface Mount; Package Quantity: 10000; PackageDescription: 2-Pin Surface Mount Device, Body 1 x 0.5 mm; Packaging: Tape and Reel; PartNumber: ERJ-2RKF2001X; RoHSCompliant: true; Tolerance: 1%; Width: 0.5 mm; Height: 0.35 mm; Mount: Surface Mount; PackageReference: 0402; Pins: 2; Radiation Hardening: No; REACH SVHC: Unknown
R126 = E102: Chip Resistor, 12.1 KOhm, +/- 1%, 63 mW, -55 to 155 degC, 0402 (1005 Metric), RoHS, Tape and Reel; Manufacturer: Basic Passives; Тип элемента: Резистор; Case\/Package: 0402; Voltage Rating: 50 V; Power Rating: 63 mW; Old_des: R299; New_des: R146; UID: E102; Component Kind: Standard; Case Code (Imperial): 0402; Case Code (Metric): 1005; ComponentLink1Description: Manufacturer URL; ComponentLink1URL: http://www.vishay.com/; ComponentLink2Description: Datasheet; ComponentLink2URL: http://www.vishay.com/docs/20035/dcrcwe3.pdf; DatasheetVersion: 06/2012; Length: 1 mm; Max Operating Temperature: 155 degC; Min Operating Temperature: -55 degC; Mounting Technology: Surface Mount; Package Quantity: 10000; PackageDescription: 2-Pin Surface Mount Device, Body 1 x 0.5 mm; Packaging: Tape and Reel; PartNumber: CRCW040212K1FKED; RoHSCompliant: true; Tolerance: 1%; Width: 0.5 mm; Height: 0.35 mm; Mount: Surface Mount; PackageReference: 0402; Pins: 2; Radiation Hardening: No; REACH SVHC: Unknown; Resistance: 12.1 KOhm; Weight: 2.3E-05oz
R127 = E99: Chip Resistor, 4.7 KOhm, +/- 1%, 0.1 W, -55 to 155 degC, 0402 (1005 Metric), RoHS, Tape and Reel; Тип элемента: Резистор; Case\/Package: 0402; Voltage Rating: 50 V; Power Rating: 100 mW; Old_des: R308; New_des: R145; UID: E99; Component Kind: Standard; Case Code (Imperial): 0402; Case Code (Metric): 1005; ComponentLink1Description: Manufacturer URL; ComponentLink1URL: http://www.panasonic.com/; ComponentLink2Description: Datasheet; ComponentLink2URL: http://industrial.panasonic.com/cdbs/www-data/pdf/RDA0000/AOA0000C86.pdf; DatasheetVersion: 04/2015; Length: 1 mm; Max Operating Temperature: 155 degC; Min Operating Temperature: -55 degC; Mounting Technology: Surface Mount; Package Quantity: 1; PackageDescription: 2-Pin Surface Mount Device, Body 1 x 0.5 mm; Packaging: Cut Tape; PartNumber: ERJ-2RKF4701X; RoHSCompliant: true; Tolerance: 1%; Width: 0.5 mm; Height: 0.35 mm; Mount: Surface Mount; PackageReference: 0402; Pins: 2; Radiation Hardening: No; REACH SVHC: Yes; Resistance: 4.7 KOhm
R128 = E99: Chip Resistor, 4.7 KOhm, +/- 1%, 0.1 W, -55 to 155 degC, 0402 (1005 Metric), RoHS, Tape and Reel; Тип элемента: Резистор; Case\/Package: 0402; Voltage Rating: 50 V; Power Rating: 100 mW; Old_des: R310; New_des: R147; UID: E99; Component Kind: Standard; Case Code (Imperial): 0402; Case Code (Metric): 1005; ComponentLink1Description: Manufacturer URL; ComponentLink1URL: http://www.panasonic.com/; ComponentLink2Description: Datasheet; ComponentLink2URL: http://industrial.panasonic.com/cdbs/www-data/pdf/RDA0000/AOA0000C86.pdf; DatasheetVersion: 04/2015; Length: 1 mm; Max Operating Temperature: 155 degC; Min Operating Temperature: -55 degC; Mounting Technology: Surface Mount; Package Quantity: 1; PackageDescription: 2-Pin Surface Mount Device, Body 1 x 0.5 mm; Packaging: Cut Tape; PartNumber: ERJ-2RKF4701X; RoHSCompliant: true; Tolerance: 1%; Width: 0.5 mm; Height: 0.35 mm; Mount: Surface Mount; PackageReference: 0402; Pins: 2; Radiation Hardening: No; REACH SVHC: Yes; Resistance: 4.7 KOhm
R129 = E99: Chip Resistor, 4.7 KOhm, +/- 1%, 0.1 W, -55 to 155 degC, 0402 (1005 Metric), RoHS, Tape and Reel; Тип элемента: Резистор; Case\/Package: 0402; Voltage Rating: 50 V; Power Rating: 100 mW; Old_des: R313; New_des: R148; UID: E99; Component Kind: Standard; Case Code (Imperial): 0402; Case Code (Metric): 1005; ComponentLink1Description: Manufacturer URL; ComponentLink1URL: http://www.panasonic.com/; ComponentLink2Description: Datasheet; ComponentLink2URL: http://industrial.panasonic.com/cdbs/www-data/pdf/RDA0000/AOA0000C86.pdf; DatasheetVersion: 04/2015; Length: 1 mm; Max Operating Temperature: 155 degC; Min Operating Temperature: -55 degC; Mounting Technology: Surface Mount; Package Quantity: 1; PackageDescription: 2-Pin Surface Mount Device, Body 1 x 0.5 mm; Packaging: Cut Tape; PartNumber: ERJ-2RKF4701X; RoHSCompliant: true; Tolerance: 1%; Width: 0.5 mm; Height: 0.35 mm; Mount: Surface Mount; PackageReference: 0402; Pins: 2; Radiation Hardening: No; REACH SVHC: Yes; Resistance: 4.7 KOhm
R130 = E99: Chip Resistor, 4.7 KOhm, +/- 1%, 0.1 W, -55 to 155 degC, 0402 (1005 Metric), RoHS, Tape and Reel; Тип элемента: Резистор; Case\/Package: 0402; Voltage Rating: 50 V; Power Rating: 100 mW; Old_des: R305; New_des: R149; UID: E99; Component Kind: Standard; Case Code (Imperial): 0402; Case Code (Metric): 1005; ComponentLink1Description: Manufacturer URL; ComponentLink1URL: http://www.panasonic.com/; ComponentLink2Description: Datasheet; ComponentLink2URL: http://industrial.panasonic.com/cdbs/www-data/pdf/RDA0000/AOA0000C86.pdf; DatasheetVersion: 04/2015; Length: 1 mm; Max Operating Temperature: 155 degC; Min Operating Temperature: -55 degC; Mounting Technology: Surface Mount; Package Quantity: 1; PackageDescription: 2-Pin Surface Mount Device, Body 1 x 0.5 mm; Packaging: Cut Tape; PartNumber: ERJ-2RKF4701X; RoHSCompliant: true; Tolerance: 1%; Width: 0.5 mm; Height: 0.35 mm; Mount: Surface Mount; PackageReference: 0402; Pins: 2; Radiation Hardening: No; REACH SVHC: Yes; Resistance: 4.7 KOhm
R131 = E99: Chip Resistor, 4.7 KOhm, +/- 1%, 0.1 W, -55 to 155 degC, 0402 (1005 Metric), RoHS, Tape and Reel; Тип элемента: Резистор; Case\/Package: 0402; Voltage Rating: 50 V; Power Rating: 100 mW; Old_des: R312; New_des: R150; UID: E99; Component Kind: Standard; Case Code (Imperial): 0402; Case Code (Metric): 1005; ComponentLink1Description: Manufacturer URL; ComponentLink1URL: http://www.panasonic.com/; ComponentLink2Description: Datasheet; ComponentLink2URL: http://industrial.panasonic.com/cdbs/www-data/pdf/RDA0000/AOA0000C86.pdf; DatasheetVersion: 04/2015; Length: 1 mm; Max Operating Temperature: 155 degC; Min Operating Temperature: -55 degC; Mounting Technology: Surface Mount; Package Quantity: 1; PackageDescription: 2-Pin Surface Mount Device, Body 1 x 0.5 mm; Packaging: Cut Tape; PartNumber: ERJ-2RKF4701X; RoHSCompliant: true; Tolerance: 1%; Width: 0.5 mm; Height: 0.35 mm; Mount: Surface Mount; PackageReference: 0402; Pins: 2; Radiation Hardening: No; REACH SVHC: Yes; Resistance: 4.7 KOhm
R132 = E99: Chip Resistor, 4.7 KOhm, +/- 1%, 0.1 W, -55 to 155 degC, 0402 (1005 Metric), RoHS, Tape and Reel; Тип элемента: Резистор; Case\/Package: 0402; Voltage Rating: 50 V; Power Rating: 100 mW; Old_des: R309; New_des: R151; UID: E99; Component Kind: Standard; Case Code (Imperial): 0402; Case Code (Metric): 1005; ComponentLink1Description: Manufacturer URL; ComponentLink1URL: http://www.panasonic.com/; ComponentLink2Description: Datasheet; ComponentLink2URL: http://industrial.panasonic.com/cdbs/www-data/pdf/RDA0000/AOA0000C86.pdf; DatasheetVersion: 04/2015; Length: 1 mm; Max Operating Temperature: 155 degC; Min Operating Temperature: -55 degC; Mounting Technology: Surface Mount; Package Quantity: 1; PackageDescription: 2-Pin Surface Mount Device, Body 1 x 0.5 mm; Packaging: Cut Tape; PartNumber: ERJ-2RKF4701X; RoHSCompliant: true; Tolerance: 1%; Width: 0.5 mm; Height: 0.35 mm; Mount: Surface Mount; PackageReference: 0402; Pins: 2; Radiation Hardening: No; REACH SVHC: Yes; Resistance: 4.7 KOhm
R133 = E99: Chip Resistor, 4.7 KOhm, +/- 1%, 0.1 W, -55 to 155 degC, 0402 (1005 Metric), RoHS, Tape and Reel; Тип элемента: Резистор; Case\/Package: 0402; Voltage Rating: 50 V; Power Rating: 100 mW; Old_des: R307; New_des: R152; UID: E99; Component Kind: Standard; Case Code (Imperial): 0402; Case Code (Metric): 1005; ComponentLink1Description: Manufacturer URL; ComponentLink1URL: http://www.panasonic.com/; ComponentLink2Description: Datasheet; ComponentLink2URL: http://industrial.panasonic.com/cdbs/www-data/pdf/RDA0000/AOA0000C86.pdf; DatasheetVersion: 04/2015; Length: 1 mm; Max Operating Temperature: 155 degC; Min Operating Temperature: -55 degC; Mounting Technology: Surface Mount; Package Quantity: 1; PackageDescription: 2-Pin Surface Mount Device, Body 1 x 0.5 mm; Packaging: Cut Tape; PartNumber: ERJ-2RKF4701X; RoHSCompliant: true; Tolerance: 1%; Width: 0.5 mm; Height: 0.35 mm; Mount: Surface Mount; PackageReference: 0402; Pins: 2; Radiation Hardening: No; REACH SVHC: Yes; Resistance: 4.7 KOhm
R134 = E99: Chip Resistor, 4.7 KOhm, +/- 1%, 0.1 W, -55 to 155 degC, 0402 (1005 Metric), RoHS, Tape and Reel; Тип элемента: Резистор; Case\/Package: 0402; Voltage Rating: 50 V; Power Rating: 100 mW; Old_des: R304; New_des: R153; UID: E99; Component Kind: Standard; Case Code (Imperial): 0402; Case Code (Metric): 1005; ComponentLink1Description: Manufacturer URL; ComponentLink1URL: http://www.panasonic.com/; ComponentLink2Description: Datasheet; ComponentLink2URL: http://industrial.panasonic.com/cdbs/www-data/pdf/RDA0000/AOA0000C86.pdf; DatasheetVersion: 04/2015; Length: 1 mm; Max Operating Temperature: 155 degC; Min Operating Temperature: -55 degC; Mounting Technology: Surface Mount; Package Quantity: 1; PackageDescription: 2-Pin Surface Mount Device, Body 1 x 0.5 mm; Packaging: Cut Tape; PartNumber: ERJ-2RKF4701X; RoHSCompliant: true; Tolerance: 1%; Width: 0.5 mm; Height: 0.35 mm; Mount: Surface Mount; PackageReference: 0402; Pins: 2; Radiation Hardening: No; REACH SVHC: Yes; Resistance: 4.7 KOhm